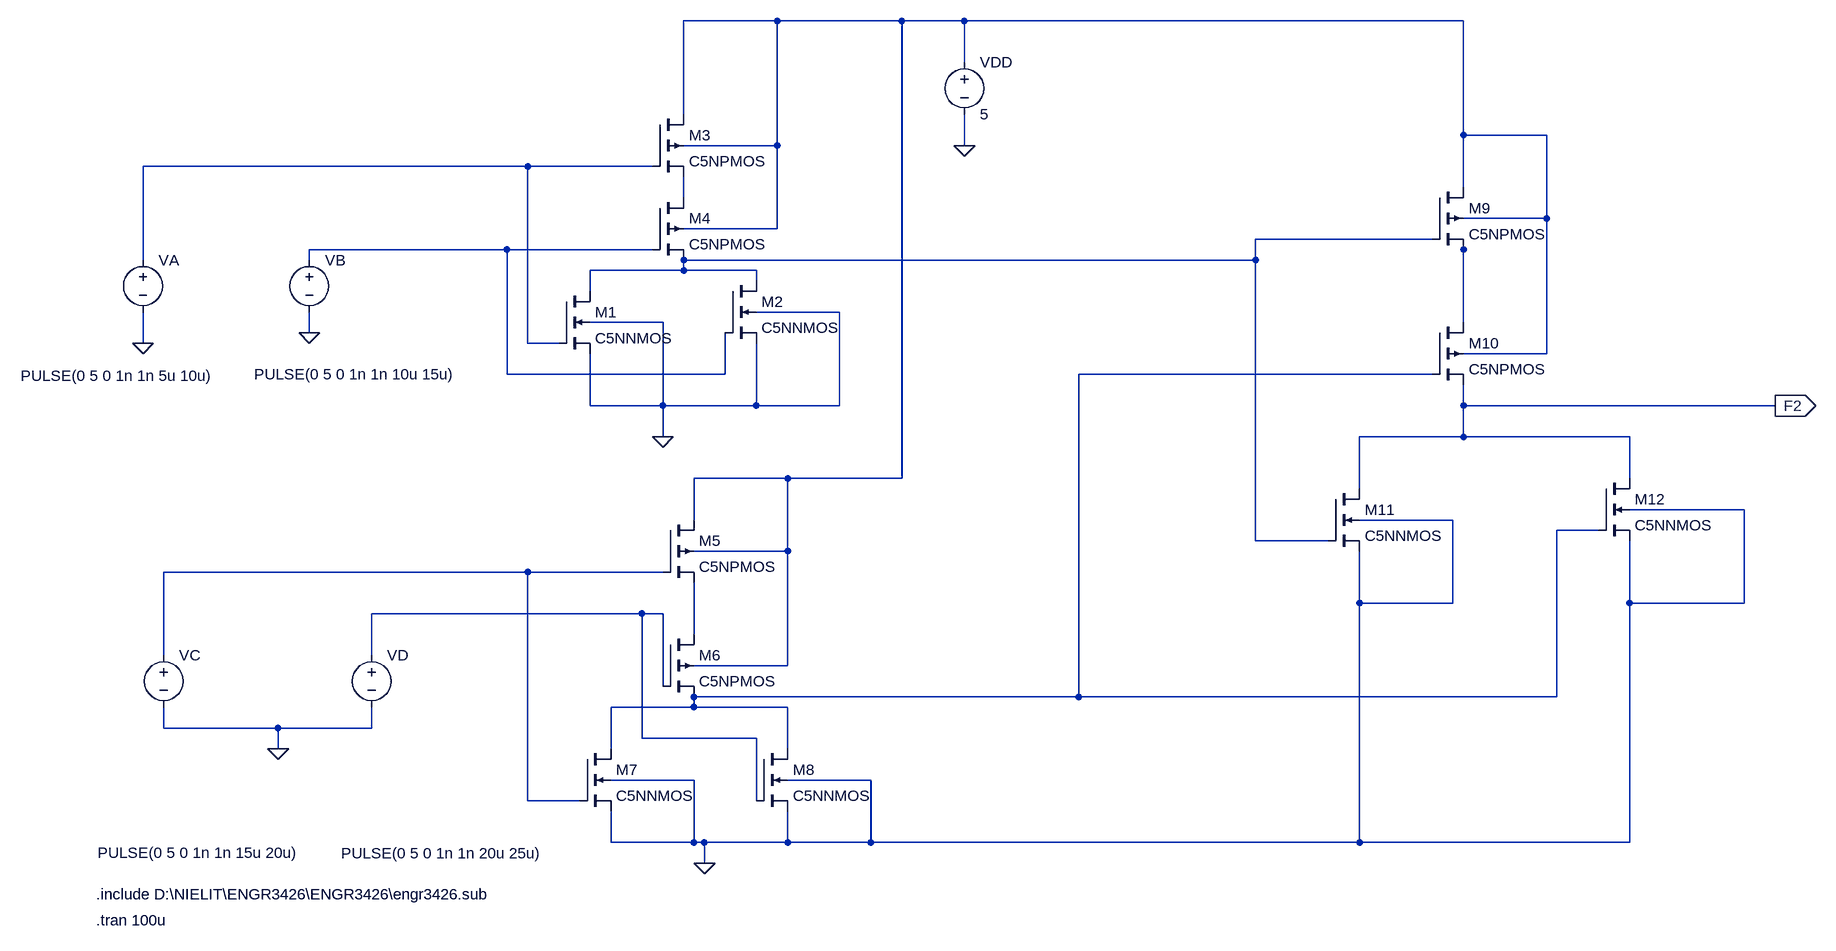
[diagram p0: schematic F2.asc]
F2.asc, the LTspice schematic file:
Version 4
SHEET 1 1992 1048
WIRE 368 -352 224 -352
WIRE 560 -352 368 -352
WIRE 656 -352 560 -352
WIRE 1424 -352 656 -352
WIRE 656 -288 656 -352
WIRE 224 -208 224 -352
WIRE 1424 -176 1424 -352
WIRE 1552 -176 1424 -176
WIRE 368 -160 368 -352
WIRE 368 -160 224 -160
WIRE 656 -160 656 -208
WIRE -16 -128 -608 -128
WIRE 176 -128 -16 -128
WIRE 1424 -96 1424 -176
WIRE 224 -80 224 -112
WIRE 1552 -48 1552 -176
WIRE 1552 -48 1424 -48
WIRE 368 -32 368 -160
WIRE 368 -32 224 -32
WIRE 1376 -16 1104 -16
WIRE -48 0 -352 0
WIRE 176 0 -48 0
WIRE 1424 0 1424 -16
WIRE -608 16 -608 -128
WIRE -352 16 -352 0
WIRE 1104 16 1104 -16
WIRE 1104 16 224 16
WIRE 224 32 224 16
WIRE 224 32 80 32
WIRE 336 32 224 32
WIRE 336 48 336 32
WIRE 80 64 80 32
WIRE 464 96 336 96
WIRE 192 112 80 112
WIRE 1424 112 1424 0
WIRE -352 128 -352 96
WIRE -608 144 -608 96
WIRE -16 144 -16 -128
WIRE 32 144 -16 144
WIRE 1552 160 1552 -48
WIRE 1552 160 1424 160
WIRE -48 192 -48 0
WIRE 288 192 288 128
WIRE 288 192 -48 192
WIRE 1376 192 832 192
WIRE 80 240 80 160
WIRE 192 240 192 112
WIRE 192 240 80 240
WIRE 336 240 336 144
WIRE 336 240 192 240
WIRE 464 240 464 96
WIRE 464 240 336 240
WIRE 1424 240 1424 208
WIRE 1904 240 1424 240
WIRE 192 288 192 240
WIRE 1424 288 1424 240
WIRE 1424 288 1264 288
WIRE 1680 288 1424 288
WIRE 384 352 240 352
WIRE 560 352 560 -352
WIRE 560 352 384 352
WIRE 1680 352 1680 288
WIRE 1264 368 1264 288
WIRE 1856 400 1680 400
WIRE 240 416 240 352
WIRE 1408 416 1264 416
WIRE 1632 432 1568 432
WIRE 1104 448 1104 16
WIRE 1216 448 1104 448
WIRE 384 464 384 352
WIRE 384 464 240 464
WIRE -16 496 -576 496
WIRE 192 496 -16 496
WIRE 1264 544 1264 464
WIRE 1408 544 1408 416
WIRE 1408 544 1264 544
WIRE 1680 544 1680 448
WIRE 1856 544 1856 400
WIRE 1856 544 1680 544
WIRE 160 560 -256 560
WIRE 192 560 160 560
WIRE 240 592 240 512
WIRE -576 624 -576 496
WIRE -256 624 -256 560
WIRE 384 640 384 464
WIRE 384 640 240 640
WIRE 192 672 192 560
WIRE 832 688 832 192
WIRE 832 688 240 688
WIRE 1568 688 1568 432
WIRE 1568 688 832 688
WIRE 240 704 240 688
WIRE 240 704 112 704
WIRE 384 704 240 704
WIRE -576 736 -576 704
WIRE -400 736 -576 736
WIRE -256 736 -256 704
WIRE -256 736 -400 736
WIRE 160 752 160 560
WIRE 336 752 160 752
WIRE -400 768 -400 736
WIRE 112 768 112 704
WIRE 384 768 384 704
WIRE 240 816 112 816
WIRE 512 816 384 816
WIRE -16 848 -16 496
WIRE 64 848 -16 848
WIRE 336 848 336 752
WIRE 112 912 112 864
WIRE 240 912 240 816
WIRE 240 912 112 912
WIRE 256 912 240 912
WIRE 384 912 384 864
WIRE 384 912 256 912
WIRE 512 912 512 816
WIRE 512 912 384 912
WIRE 1264 912 1264 544
WIRE 1264 912 512 912
WIRE 1680 912 1680 544
WIRE 1680 912 1264 912
WIRE 256 944 256 912
FLAG -608 144 0
FLAG -352 128 0
FLAG 656 -160 0
FLAG -400 768 0
FLAG 256 944 0
FLAG 192 288 0
FLAG 1904 240 F2
IOPIN 1904 240 Out
SYMBOL nmos4 288 48 R0
SYMATTR InstName M2
SYMATTR Value C5NNMOS
SYMATTR Value2 l=0.6u w=3.6u
SYMBOL pmos4 176 -208 R0
SYMATTR InstName M3
SYMATTR Value C5NPMOS
SYMATTR Value2 l=0.6u w=7.2u
SYMBOL pmos4 176 -80 R0
SYMATTR InstName M4
SYMATTR Value C5NPMOS
SYMATTR Value2 l=0.6u w=7.2u
SYMBOL pmos4 192 416 R0
SYMATTR InstName M5
SYMATTR Value C5NPMOS
SYMATTR Value2 l=0.6u w=7.2u
SYMBOL pmos4 192 592 R0
SYMATTR InstName M6
SYMATTR Value C5NPMOS
SYMATTR Value2 l=0.6u w=7.2u
SYMBOL nmos4 64 768 R0
SYMATTR InstName M7
SYMATTR Value C5NNMOS
SYMATTR Value2 l=0.6u w=3.6u
SYMBOL nmos4 336 768 R0
SYMATTR InstName M8
SYMATTR Value C5NNMOS
SYMATTR Value2 l=0.6u w=3.6u
SYMBOL voltage 656 -304 R0
SYMATTR InstName VDD
SYMATTR Value 5
SYMBOL voltage -608 0 R0
WINDOW 3 -188 194 Left 2
WINDOW 123 0 0 Left 0
WINDOW 39 0 0 Left 0
SYMATTR Value PULSE(0 5 0 1n 1n 5u 10u)
SYMATTR InstName VA
SYMBOL voltage -352 0 R0
WINDOW 3 -85 192 Left 2
WINDOW 123 0 0 Left 0
WINDOW 39 0 0 Left 0
SYMATTR Value PULSE(0 5 0 1n 1n 10u 15u)
SYMATTR InstName VB
SYMBOL voltage -576 608 R0
WINDOW 3 -102 320 Left 2
WINDOW 123 0 0 Left 0
WINDOW 39 0 0 Left 0
SYMATTR Value PULSE(0 5 0 1n 1n 15u 20u)
SYMATTR InstName VC
SYMBOL voltage -256 608 R0
WINDOW 3 -47 321 Left 2
WINDOW 123 0 0 Left 0
WINDOW 39 0 0 Left 0
SYMATTR Value PULSE(0 5 0 1n 1n 20u 25u)
SYMATTR InstName VD
SYMBOL nmos4 32 64 R0
SYMATTR InstName M1
SYMATTR Value C5NNMOS
SYMATTR Value2 l=0.6u w=3.6u
SYMBOL pmos4 1376 -96 R0
SYMATTR InstName M9
SYMATTR Value C5NPMOS
SYMATTR Value2 l=0.6u w=7.2u
SYMBOL pmos4 1376 112 R0
SYMATTR InstName M10
SYMATTR Value C5NPMOS
SYMATTR Value2 l=0.6u w=7.2u
SYMBOL nmos4 1216 368 R0
SYMATTR InstName M11
SYMATTR Value C5NNMOS
SYMATTR Value2 l=0.6u w=3.6u
SYMBOL nmos4 1632 352 R0
SYMATTR InstName M12
SYMATTR Value C5NNMOS
SYMATTR Value2 l=0.6u w=3.6u
TEXT -680 992 Left 2 !.include D:\\NIELIT\\ENGR3426\\ENGR3426\\engr3426.sub
TEXT -680 1032 Left 2 !.tran 100u

The netlist it stands for:
* F2.asc
M2 N004 N005 0 0 C5NNMOS l=0.6u w=3.6u
M3 N001 N002 N003 N001 C5NPMOS l=0.6u w=7.2u
M4 N003 N005 N004 N001 C5NPMOS l=0.6u w=7.2u
M5 N001 N008 N010 N001 C5NPMOS l=0.6u w=7.2u
M6 N010 N009 N007 N001 C5NPMOS l=0.6u w=7.2u
M7 N007 N008 0 0 C5NNMOS l=0.6u w=3.6u
M8 N007 N009 0 0 C5NNMOS l=0.6u w=3.6u
VDD N001 0 5
VA N002 0 PULSE(0 5 0 1n 1n 5u 10u)
VB N005 0 PULSE(0 5 0 1n 1n 10u 15u)
VC N008 0 PULSE(0 5 0 1n 1n 15u 20u)
VD N009 0 PULSE(0 5 0 1n 1n 20u 25u)
M1 N004 N002 0 0 C5NNMOS l=0.6u w=3.6u
M9 N001 N004 N006 N001 C5NPMOS l=0.6u w=7.2u
M10 N006 N007 F2 N001 C5NPMOS l=0.6u w=7.2u
M11 F2 N004 0 0 C5NNMOS l=0.6u w=3.6u
M12 F2 N007 0 0 C5NNMOS l=0.6u w=3.6u
.model NMOS NMOS
.model PMOS PMOS
.lib standard.mos
.include D:\NIELIT\ENGR3426\ENGR3426\engr3426.sub
.tran 100u
.backanno
.end